# Altium schematic sheet TermWylPompy1_main.SchDoc
size A4; LotOfPieces: 1
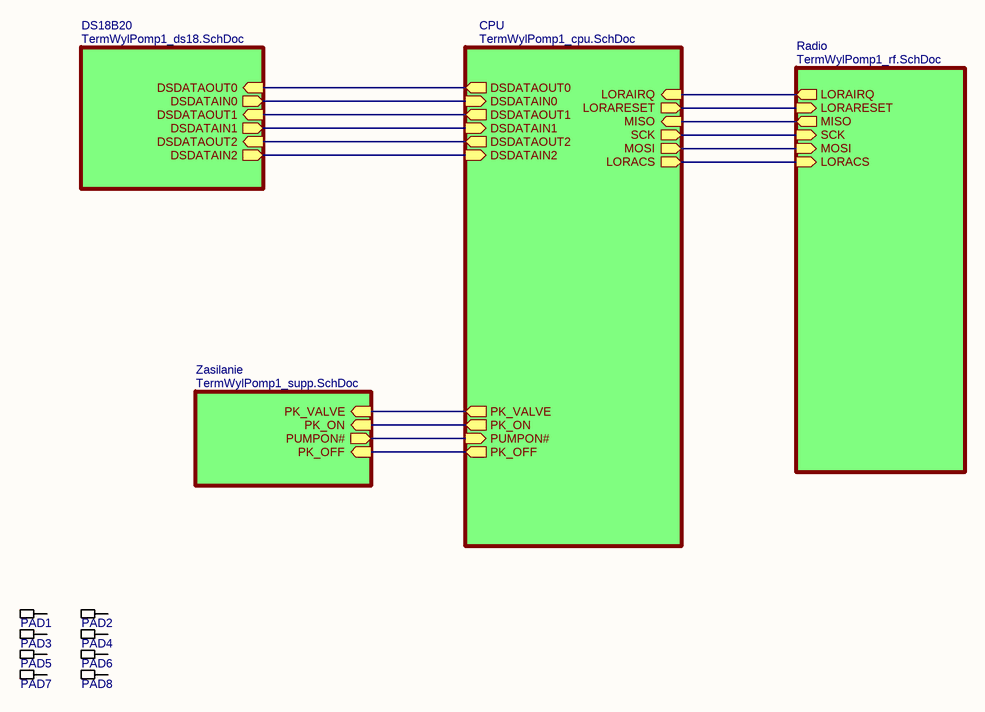
[diagram p0: TermWylPompy1_main.SchDoc]

## Parts
PAD1  PAD3_5MM  [PAD3_5MM]  (value not drawn)  (no BOM)
PAD2  PAD3_5MM  [PAD3_5MM]  (value not drawn)  (no BOM)
PAD3  PAD3_5MM  [PAD3_5MM]  (value not drawn)  (no BOM)
PAD4  PAD3_5MM  [PAD3_5MM]  (value not drawn)  (no BOM)
PAD5  PAD3_5MM  [PAD3_5MM]  (value not drawn)  (no BOM)
PAD6  PAD3_5MM  [PAD3_5MM]  (value not drawn)  (no BOM)
PAD7  PAD3_5MM  [PAD3_5MM]  (value not drawn)  (no BOM)
PAD8  PAD3_5MM  [PAD3_5MM]  (value not drawn)  (no BOM)

## Sub-sheets
CPU = TermWylPomp1_cpu.SchDoc: DSDATAIN1 (in), DSDATAOUT0 (out), DSDATAOUT1 (out), DSDATAIN0 (in), PUMPON# (in), PK_OFF (out), DSDATAOUT2 (out), DSDATAIN2 (in), LORAIRQ (in), LORARESET (out), MISO (in), SCK (out), MOSI (out), LORACS (out), PK_ON (out), PK_VALVE (out)
DS18B20 = TermWylPomp1_ds18.SchDoc: DSDATAIN1 (out), DSDATAOUT0 (in), DSDATAOUT1 (in), DSDATAIN0 (out), DSDATAOUT2 (in), DSDATAIN2 (out)
Radio = TermWylPomp1_rf.SchDoc: LORAIRQ (out), LORARESET (in), MISO (out), SCK (in), MOSI (in), LORACS (in)
Zasilanie = TermWylPomp1_supp.SchDoc: PUMPON# (out), PK_OFF (in), PK_ON (in), PK_VALVE (in)

## Nets
(unnamed): sheet CPU/DSDATAIN1, sheet DS18B20/DSDATAIN1
(unnamed): sheet CPU/DSDATAOUT0, sheet DS18B20/DSDATAOUT0
(unnamed): sheet CPU/DSDATAOUT1, sheet DS18B20/DSDATAOUT1
(unnamed): sheet CPU/DSDATAIN0, sheet DS18B20/DSDATAIN0
(unnamed): sheet CPU/PUMPON#, sheet Zasilanie/PUMPON#
(unnamed): sheet CPU/PK_OFF, sheet Zasilanie/PK_OFF
(unnamed): sheet CPU/DSDATAOUT2, sheet DS18B20/DSDATAOUT2
(unnamed): sheet CPU/DSDATAIN2, sheet DS18B20/DSDATAIN2
(unnamed): sheet CPU/LORAIRQ, sheet Radio/LORAIRQ
(unnamed): sheet CPU/LORARESET, sheet Radio/LORARESET
(unnamed): sheet CPU/MISO, sheet Radio/MISO
(unnamed): sheet CPU/SCK, sheet Radio/SCK
(unnamed): sheet CPU/MOSI, sheet Radio/MOSI
(unnamed): sheet CPU/LORACS, sheet Radio/LORACS
(unnamed): sheet CPU/PK_ON, sheet Zasilanie/PK_ON
(unnamed): sheet CPU/PK_VALVE, sheet Zasilanie/PK_VALVE

Not connected (* = marked no-connect by the designer): PAD1 1; PAD2 1; PAD3 1; PAD4 1; PAD5 1; PAD6 1; PAD7 1; PAD8 1

## Notes on the sheet
- Wariant:
- Rev.
- /
- Projekt i wykonanie: (C) Miroslaw Lach MRQ, www.mlach.com
- git:
- Page:
- Plik:

## Library data of the parts
PAD1-PAD8 = Oth106: PartIdx: Oth106; Identyfikator: 106; Descript: bd; Value: PAD3_5MM; DateOfPrice5: 2010-01-01; Price5: -1; Supplier5: bd; Manufacturer5: bd; Reference5: bd; Typ5: bd; ID: 106